# EAGLE design telematics_board_v2 (EAGLE 9.7.0)
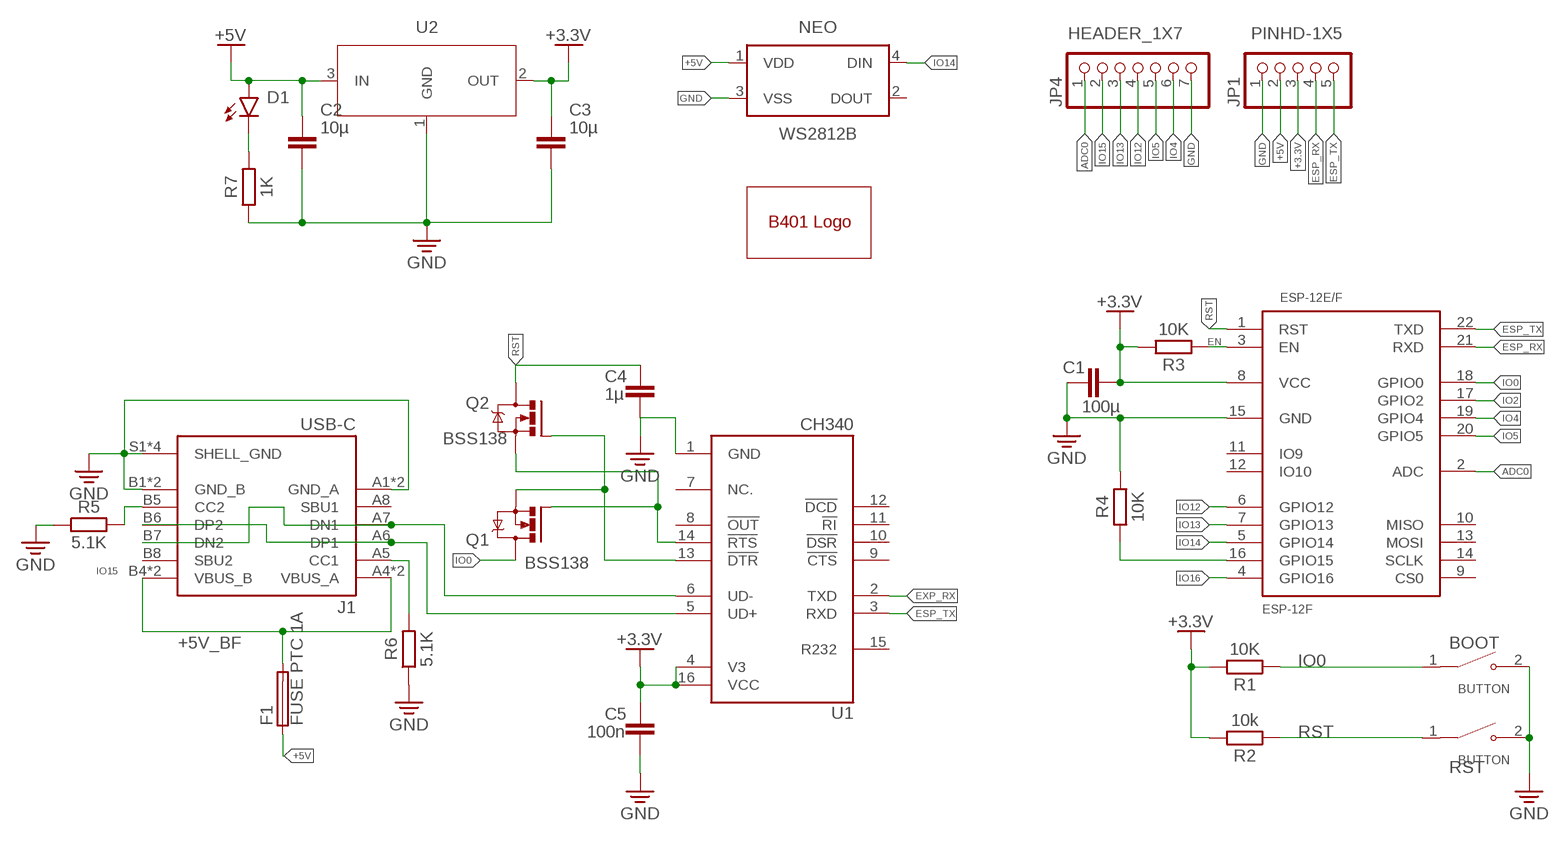
[diagram p0: schematic, sheet 1]

## Parts
BOOT  BUTTON  [SWITCH-2P]
C1  100µ  C_TANTALUM-2412(6032-METRIC)  [CAPM6032X280]
C2  10µ  C_CHIP-0805(2012-METRIC)  [CAPC2012X110]
C3  10µ  C_CHIP-0805(2012-METRIC)  [CAPC2012X110]
C4  1µ  C_CHIP-0805(2012-METRIC)  [CAPC2012X110]
C5  100n  C_CHIP-0805(2012-METRIC)  [CAPC2012X110]
D1  LED_RED  CHIP-FLAT-R_0805  [LEDC2012X110N_FLAT-R]
ESP-12E/F  ESP-12F  [ESP-12F]
F1  FUSE PTC 1A  FUSE_CHIP-1206(3216-METRIC)  [FUSC3215X82N]
J1  USB-C  [USB-C-16P]
JP1  PINHD-1X5  HEADER_1X5  [1X05]
JP4  HEADER_1X7  [1X07]
NEO  WS2812B  [WS2812B]
Q1  BSS138  NMOSFETSOT23-GSD  [SOT23]
Q2  BSS138  NMOSFETSOT23-GSD  [SOT23]
R1  10K  R_CHIP-0805(2012-METRIC)  [RESC2012X65]
R2  10k  R_CHIP-0805(2012-METRIC)  [RESC2012X65]
R3  10K  R_CHIP-0805(2012-METRIC)  [RESC2012X65]
R4  10K  R_CHIP-0805(2012-METRIC)  [RESC2012X65]
R5  5.1K  R_CHIP-0805(2012-METRIC)  [RESC2012X65]
R6  5.1K  R_CHIP-0805(2012-METRIC)  [RESC2012X65]
R7  1K  R_CHIP-0805(2012-METRIC)  [RESC2012X65]
RST  BUTTON  [SWITCH-2P]
U1  CH340  [SOIC127P600X180-16N]
U2  NCP1117ST33T3G  NCP1117ST33T3GSOT-223  [SOT230P700X170-4]
U$1  LOGO_B401LARGE  [B401_LARGE]

## Nets
+3.3V: C1.2 C3.1 C5.1 ESP-12E/F.8(VCC) JP1.3 R1.2 R2.2 R3.2 U1.4(V3) U1.16(VCC) U2.2(OUT)
+5V: C2.1 D1.A F1.1 JP1.2 NEO.1(VDD) U2.3(IN)
+5V_BF: F1.2 J1.A4(VBUS_A) J1.A9(VBUS_A) J1.B4(VBUS_B) J1.B9(VBUS_B)
ADC0: ESP-12E/F.2(ADC) JP4.1
EN: ESP-12E/F.3(EN) R3.1
ESP_RX: ESP-12E/F.21(RXD) JP1.4
ESP_TX: ESP-12E/F.22(TXD) JP1.5 U1.3(RXD)
EXP_RX: U1.2(TXD)
GND: BOOT.2 C1.1 C2.2 C3.2 C4.2 C5.2 ESP-12E/F.15(GND) J1.A1(GND_A) J1.A12(GND_A) J1.B1(GND_B) J1.B12(GND_B) J1.S1(SHELL_GND) J1.S2(SHELL_GND) J1.S3(SHELL_GND) J1.S4(SHELL_GND) JP1.1 JP4.7 NEO.3(VSS) R4.2 R5.1 R6.1 R7.1 RST.2 U1.1(GND) U2.1(GND)
IO0: BOOT.1 ESP-12E/F.18(GPIO0) Q1.3(D) R1.1
IO2: ESP-12E/F.17(GPIO2)
IO4: ESP-12E/F.19(GPIO4) JP4.6
IO5: ESP-12E/F.20(GPIO5) JP4.5
IO12: ESP-12E/F.6(GPIO12) JP4.4
IO13: ESP-12E/F.7(GPIO13) JP4.3
IO14: ESP-12E/F.5(GPIO14) NEO.4(DIN)
IO15: ESP-12E/F.16(GPIO15) JP4.2 R4.1
IO16: ESP-12E/F.4(GPIO16)
N$1: J1.A6(DP1) J1.B6(DP2) U1.5(UD+)
N$2: J1.A7(DN1) J1.B7(DN2) U1.6(UD-)
N$4: Q1.2(S) Q2.1(G) U1.13(!DTR)
N$5: J1.B5(CC2) R5.2
N$6: J1.A5(CC1) R6.2
N$8: Q1.1(G) Q2.2(S) U1.14(!RTS)
N$9: D1.C R7.2
RST: C4.1 ESP-12E/F.1(RST) Q2.3(D) R2.1 RST.1
Unconnected: ESP-12E/F.9(CS0) ESP-12E/F.10(MISO) ESP-12E/F.11(IO9) ESP-12E/F.12(IO10) ESP-12E/F.13(MOSI) ESP-12E/F.14(SCLK) J1.A8(SBU1) J1.B8(SBU2) NEO.2(DOUT) U1.7(NC.) U1.8(!OUT) U1.9(!CTS) U1.10(!DSR) U1.11(!RI) U1.12(!DCD) U1.15(R232)

## Library data of the parts
BOOT RST = WorTel Libray 2024:BUTTON; MANUFACTURER: CUI Devices; MAXIMUM_PACKAGE_HEIGHT: 2.5 mm; PARTREV: 1.0; STANDARD: Manufacturer Recommendations
C1-C5 = Capacitor:C: Capacitor - Generic; CATEGORY: Capacitor
D1 = LED:CHIP-FLAT-R; CATEGORY: LED; COLOR: RED; DESCRIPTION: CHIP LED FLAT; SUB-CATEGORY: CHIP; TYPE: FLAT_TOP
ESP-12E/F = WorTel Libray 2024:ESP-12F
F1 = Circuit-Protection:FUSE: Fuse - Generic; CATEGORY: Circuit-Protection; SUB-CATEGORY: Fuse
J1 = WorTel Libray 2024:USB-C: Check availability <https://pricing.snapeda.com/parts/CSP-USC16-TR/Valcon/view-part?ref=eda>; AVAILABILITY: In Stock; CHECK_PRICES: https://www.snapeda.com/parts/CSP-USC16-TR/Valcon/view-part/?ref=eda; DESCRIPTION: CSP-USC16-TR Valcon USB Type C Surface Mount PCB Socket; MF: Valcon; MP: CSP-USC16-TR; PACKAGE: None; PRICE: None; SNAPEDA_LINK: https://www.snapeda.com/parts/CSP-USC16-TR/Valcon/view-part/?ref=snap
JP1 = WorTel Libray 2024:HEADER_1X5: PIN HEADER; CATEGORY: Headers; DESCRIPTION: Header, Straight, 5 Position; MANUFACTURER: Generic; MPN: Generic; OPERATING_TEMPERATURE: Generic; PART_STATUS: Active; PITCH: 0.100" (2.54mm); ROHS_COMPLIANCE: Generic; SERIES: Generic; SUB-CATEGORY: Headers, Male Pins; TYPE: Board to Board or Cable, Unshrouded, Through Hole, Straight
JP4 = WorTel Libray 2024:HEADER_1X7: PIN HEADER; CATEGORY: Headers; DESCRIPTION: Header, Straight, 7 Position; MANUFACTURER: Generic; MPN: Generic; OPERATING_TEMPERATURE: Generic; PART_STATUS: Active; PITCH: 0.100" (2.54mm); ROHS_COMPLIANCE: Generic; SERIES: Generic; SUB-CATEGORY: Headers, Male Pins; TYPE: Board to Board or Cable, Unshrouded, Through Hole, Straight
NEO = LED:WS2812B: Intelligent control LED integrated light source Datasheet <http://cdn.sparkfun.com/datasheets/BreakoutBoards/WS2812B.pdf>; CATEGORY: LED; COLOR: RGB; DESCRIPTION: LED integrated light source; MANUFACTURER: Worldsemi; MPN: WS2812B; OPERATING_TEMP: -25 ℃ to +80℃(TJ); PART_STATUS: Active; SUB_CATEGORY: RGB
Q1 Q2 = Transistor:NMOSFET: N-Channel MOSFET - Generic; CATEGORY: Transistor; SUB-CATEGORY: MOSFET; TYPE: N-Channel; VALUE: NMOSFET
R1-R7 = Resistor:R: Resistor Fixed - Generic; CATEGORY: Resistor; SUB-CATEGORY: Fixed
U1 = WorTel Libray 2024:CH340: USB to serial chip CH340 Check availability <https://pricing.snapeda.com/parts/CH340C/WCH/view-part?ref=eda>; AVAILABILITY: Not in stock; CHECK_PRICES: https://www.snapeda.com/parts/CH340C/WCH/view-part/?ref=eda; DESCRIPTION: USB to serial chip CH340; MF: WCH; MP: CH340C; PACKAGE: None; PRICE: None; SNAPEDA_LINK: https://www.snapeda.com/parts/CH340C/WCH/view-part/?ref=snap
U2 = IC_Power-Management:NCP1117ST33T3G: 1.0 A Low-Dropout Positive Fixed and Adjustable Voltage Regulators Datasheet <https://www.onsemi.com/pub/Collateral/NCP1117-D.PDF>; CATEGORY: IC_Power-Management; MANUFACTURER: ON Semiconductor; MPN: NCP1117ST33T3G; OPERATING_TEMP: 0 to +125 °C; PART_STATUS: Active; ROHS_COMPLIANT: RoHS3 Compliant; SERIES: NCP1117, NCV1117; SUB-CATEGORY: Voltage Regulator; TYPE: Linear
U$1 = WorTel Libray 2024:LOGO_B401

## Board
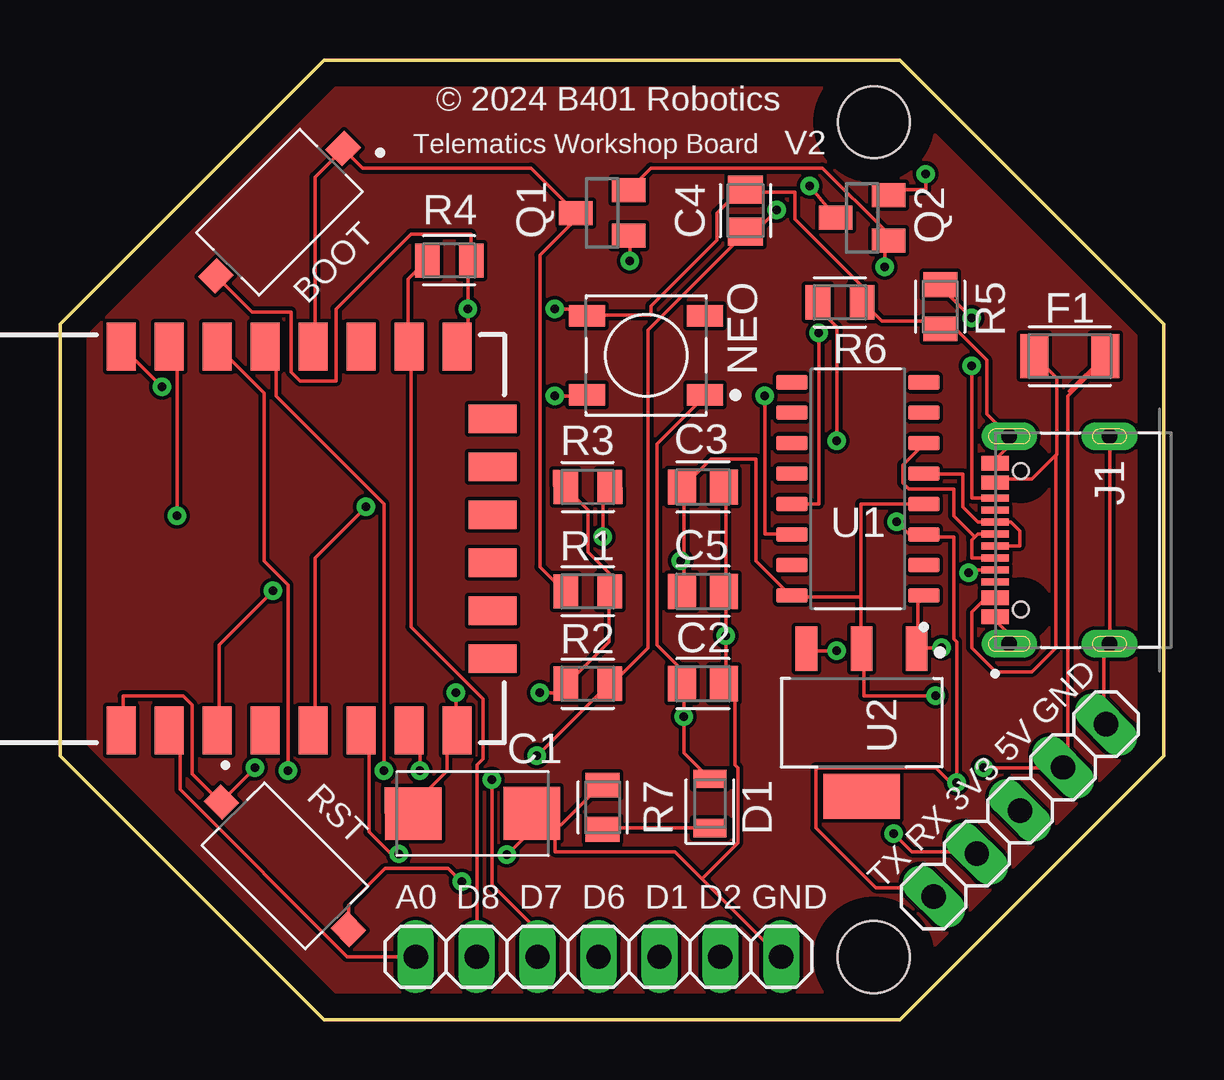
[diagram p1: board, top side]
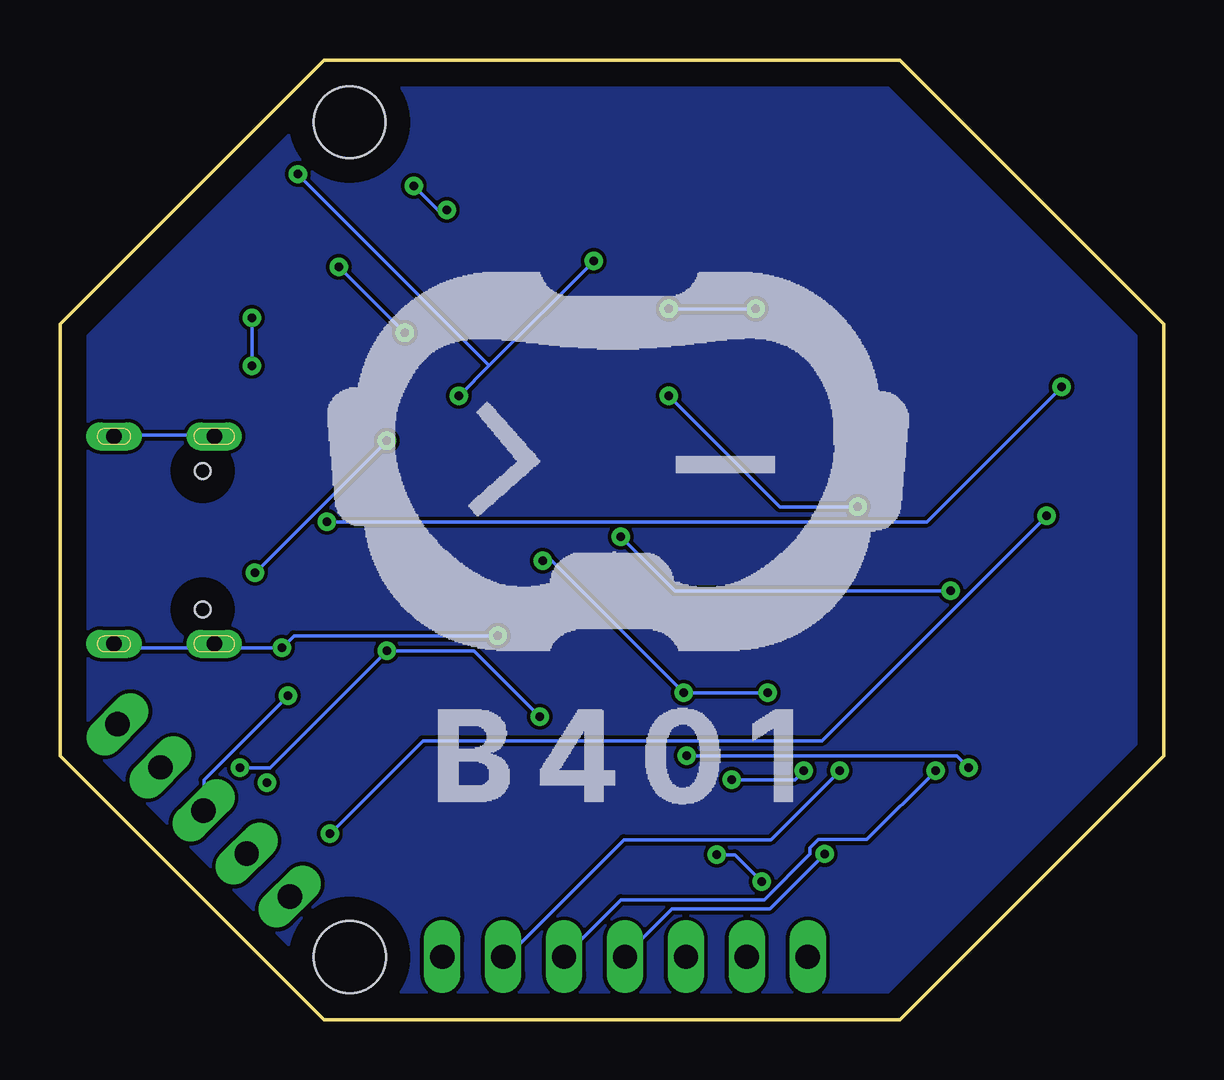
[diagram p2: board, bottom side, seen from below]

Size 46 x 40 mm. Coordinates in mm from the lower left corner, seen from the top.
Outline: 11,40 35,40 46,29 46,11 35,0 11,0 0,11 0,29 11,40
Copper layers (1*16): Top 0.035mm / dielectric 1.5mm / Bottom 0.035mm
Design rules "default *": minimum track width 6mil, minimum drill 0.35mm, track to track 6mil, track to pad 6mil, pad to pad 6mil, via to via 6mil, smd to smd 6mil, copper to edge 40mil, drill to drill 6mil, minimum pad ring 10mil, minimum via ring 8mil, stop-mask expansion 4mil, vias tented up to drill 0mil, thermal gap 10mil
Holes 3 mm at 33.93,37.41 33.92,2.6

### Footprints (pad centres in the part's own frame; a part is rotated, then mirrored left to right if it is on the bottom)
SWITCH-2P = smd 1.1 x 1: 1 -3.75,0; 2 3.75,0
CAPM6032X280 = smd 2.368 x 2.204: 1 -2.471,0; 2 2.471,0
CAPC2012X110 = smd 1.165 x 1.465: 1 -0.875,0; 2 0.875,0
LEDC2012X110N_FLAT-R = smd 0.762 x 1.362: A 1.025,0; C -1.025,0
ESP-12F = smd 2 x 1.2: 1 -8,3.48; 2 -8,1.48; 3 -8,-0.52; 4 -8,-2.52; 5 -8,-4.52; 6 -8,-6.52; 7 -8,-8.52; 8 -8,-10.52; 15 8,-10.52; 16 8,-8.52; 17 8,-6.52; 18 8,-4.52; 19 8,-2.52; 20 8,-0.52; 21 8,1.48; 22 8,3.48 | smd 1.2 x 2: 9 -5,-12; 10 -3,-12; 11 -1,-12; 12 1,-12; 13 3,-12; 14 5,-12
FUSC3215X82N = smd 1.165 x 1.814: 1 -1.475,0; 2 1.475,0
USB-C-16P = smd 0.3 x 1.14: A1 -3.35,0; A4 -2.55,0; A5 -1.25,0; A6 -0.25,0; A7 0.25,0; A8 1.25,0; A9 2.55,0; A12 3.35,0; B1 3.05,0; B4 2.25,0; B5 1.75,0; B6 0.75,0; B7 -0.75,0; B8 -1.75,0; B9 -2.25,0; B12 -3.05,0 | drill 0.65 pad 1 long: S1 -4.325,-0.59; S2 4.325,-0.59 | drill 0.65 pad 0.9 long: S3 -4.325,-4.77; S4 4.325,-4.77 | hole 0.65: -2.89,-1.07; 2.89,-1.07
1X05 = drill 1.016 long: 1 -5.08,0; 2 -2.54,0; 3 0,0; 4 2.54,0; 5 5.08,0
1X07 = drill 1.016 long: 1 -7.62,0; 2 -5.08,0; 3 -2.54,0; 4 0,0; 5 2.54,0; 6 5.08,0; 7 7.62,0
WS2812B = smd 1.5 x 0.9: 1 -2.45,1.65; 2 -2.45,-1.65; 3 2.45,-1.65; 4 2.45,1.65
SOT23 = smd 1 x 1.4: 1 -0.95,-1.1; 2 0.95,-1.1; 3 0,1.1
RESC2012X65 = smd 1.031 x 1.42: 1 -0.919,0; 2 0.919,0
SOIC127P600X180-16N = smd 1.31 x 0.62: 1 -2.75,4.445; 2 -2.75,3.175; 3 -2.75,1.905; 4 -2.75,0.635; 5 -2.75,-0.635; 6 -2.75,-1.905; 7 -2.75,-3.175; 8 -2.75,-4.445; 9 2.75,-4.445; 10 2.75,-3.175; 11 2.75,-1.905; 12 2.75,-0.635; 13 2.75,0.635; 14 2.75,1.905; 15 2.75,3.175; 16 2.75,4.445
SOT230P700X170-4 = smd 1.86 x 0.898: 1 -3.075,2.3; 2 -3.075,0; 3 -3.075,-2.3 | smd 1.86 x 3.189: 4 3.075,0

### Placement (x,y rotation side)
BOOT  9.15,33.65 225 top
C1  17.2,8.59 180.1 top
C2  26.8,14 0 top
C3  26.8,22.2 0 top
C4  28.57,33.72 90 top
C5  26.8,17.85 0 top
D1  27.1,9.01 90 top
ESP-12E/F  6.03,20.04 90 top
F1  42.09,27.66 180 top
J1  38.98,19.98 90 top
JP1  40.01,8.71 225 top
JP4  22.45,2.62 0 top
NEO  24.43,27.68 180 top
Q1  22.61,33.62 90 top
Q2  33.44,33.42 90 top
R1  22,17.85 0 top
R2  22,14 180 top
R3  22,22.2 180.2 top
R4  16.23,31.64 0 top
R5  36.69,29.71 90 top
R6  32.52,29.9 180 top
R7  22.62,8.85 270 top
RST  9.38,6.41 315 top
U1  33.26,22.12 180 top
U2  33.42,12.38 270 top
U$1  23,22.5 0 bottom

### Tracks (layer width: path | path; a pad name or v marks a point on that pad's centre or on a via)
+3.3V  (via drill 0.35)
  Top 0.152: C1.2 14.75,8.62 14.75,9 16.12,10.38 16.12,11.62 16.5,12 ESP-12E/F.8 16.5,12.12 v16.5,13.62 | R3.2 21.12,22.12 22,21.25 22,19.5 22.88,18.62 22.88,17.88 R1.2 22.88,17.75 22.88,15.75 21.12,14 R2.2 21,14 21,13.62 v20,13.62 | 26,19.12 26,22.12 C3.1 26,22.25 27.12,23.38 29,23.38 29,19.12 30.5,17.62 U1.16 30.62,17.62 33.38,17.62 | 26,19.12 26,17.88 C5.1 | 33.38,17.62 33.38,15.5 U2.2 33.5,15.38 33.5,13.5 v36.5,13.5 | 33.38,17.62 33.38,21.5 U1.4 | 26,19.12 v25.88,19.12
  Bottom 0.152: v16.5,13.62 v20,13.62 25.5,19.12 v25.88,19.12 | v36.5,13.5 40,10 40,9 JP1.3
+5V  (via drill 0.35)
  Top 0.152: D1.A 27,10.12 26,11.12 v26,12.62 26,14 C2.1 25.88,14 25.88,14.62 24.88,15.62 24.88,24 26.88,26 NEO.1 | v32.38,15.38 31.12,15.38 U2.3 | 42.08,26.2 43.5,27.62 F1.1 43.5,27.5 42,26 42,11 JP1.2 41.5,10.5 v38.5,10.5
  Bottom 0.152: v26,12.62 28.75,15.38 v32.38,15.38 37.25,10.5 v38.5,10.5
+5V_BF
  Top 0.152: 41.49,23.51 40.52,22.53 J1.A9 J1.B4 | 41.49,23.51 41.54,23.56 41.54,26.73 F1.2 | 41.49,23.51 41.5,23.5 41.5,15.5 40.5,14.5 39,14.5 38,15.5 38,17 38.5,17.5 J1.A4 J1.B9
ADC0
  Top 0.152: ESP-12E/F.2 4.62,12 5,11.62 5,9.58 11.96,2.62 14.75,2.62 JP4.1
EN  (via drill 0.35)
  Top 0.152: v22.62,20.12 22.62,21.88 22.88,22.12 R3.1 | v8.88,17.88 6.62,15.62 6.62,12.12 ESP-12E/F.3
  Bottom 0.152: v22.62,20.12 20.38,17.88 v8.88,17.88
ESP_RX  (via drill 0.35)
  Top 0.152: v4.88,21 4.88,27.75 4.62,28 ESP-12E/F.21 | v34.75,7.75 35.5,7 38,7 JP1.4
  Bottom 0.152: v4.88,21 14.25,11.62 30.88,11.62 v34.75,7.75
ESP_TX  (via drill 0.35)
  Top 0.152: v4.25,26.38 2.62,28 ESP-12E/F.22 | v34.88,20.75 35.38,20.25 36,20.25 U1.3 36.12,20.12 37.25,20.12 37.25,15.88 37.38,15.75 v37.38,9.88 37,10 36.5,10.5 31.5,10.5 31.5,8 34,5.5 36,5.5 JP1.5
  Bottom 0.152: v4.25,26.38 9.88,20.75 v34.88,20.75
GND  (via drill 0.35)
  Top 0.152: 27.75,14 v27.75,16 27.75,17.75 C5.2 27.75,17.88 27.75,22.12 C3.2 | v18.62,6.88 19.62,7.88 19.62,8.12 | 19.62,8.12 19.62,8.5 C1.1 | 19.62,8.12 20.62,8.12 | 20.62,8.12 20.88,8.12 22.5,9.75 R7.1 | 19.62,8.12 C1.1 | 26.75,5.88 25.62,7 20.62,7 20.62,8.12 | 26.75,5.88 30,2.62 JP4.7 | 20.62,8.12 C1.1 | 27.75,14 28.12,13.62 28.12,10.62 28.25,10.5 28.25,7.38 26.75,5.88 | 27.75,14 C2.2 | 35.75,15.5 35.75,17.38 36,17.62 U1.1 | v36.75,15.5 35.75,15.5 | 35.75,15.5 U2.1 | BOOT.2 8,29.5 9.62,29.5 9.62,27 10,26.62 11.5,26.62 11.5,29.62 14.62,32.75 17.12,32.75 17.12,31.75 R4.2 17.12,31.62 17,31.5 v17,29.62 17,28.5 16.62,28.12 ESP-12E/F.15 | v20.62,29.62 21.88,29.62 21.88,29.38 NEO.3 22,29.38 24.62,29.38 24.62,29.75 27.38,32.5 27.38,33.62 28.25,34.5 28.5,34.5 C4.2 28.62,34.5 30.62,34.5 30.62,33.38 33.38,30.62 33.38,30 R6.1 33.5,29.88 34.25,29.12 36.62,29.12 36.62,28.88 R5.1 36.75,28.75 37.38,28.75 38.62,27.5 38.62,25.25 39.5,24.38 J1.S2 39.57,23.92 J1.A12 J1.B1 | J1.S4 43.75,24.25 43.75,15.75 J1.S3 43.5,15.5 43.5,12.5 JP1.1 | v16.75,5.75 16.71,5.75 16.17,6.29 13.55,6.29 12.03,4.77 RST.2 | J1.S1 39.57,16.04 J1.A1 J1.B12
  Bottom 0.152: v16.75,5.75 17.88,6.88 v18.62,6.88 | 39.75,15.5 39.62,15.62 J1.S1 39.75,15.5 | 39.75,15.5 43.5,15.5 43.62,15.62 J1.S3 | 39.75,15.5 v36.75,15.5 36.25,16 v27.75,16 | J1.S2 39.62,24.38 43.62,24.38 J1.S4 | v20.62,29.62 v17,29.62
IO0
  Top 0.152: ESP-12E/F.18 10.62,28.12 10.62,35.12 11.75,36.25 BOOT.1 12.61,35.5 19.62,35.5 Q1.3 21.5,33.5 21.5,33.38 20,31.88 20,18.88 21,17.88 R1.1
IO4  (via drill 0.35)
  Top 0.152: v13.5,10.38 13.5,21.5 9,26 9,27.62 8.62,28 ESP-12E/F.19
  Bottom 0.152: v13.5,10.38 16.38,7.5 22.5,7.5 27.38,2.62 27.5,2.62 JP4.6
IO5  (via drill 0.35)
  Top 0.152: v9.5,10.38 9.5,18.12 8.5,19.12 8.5,26.12 6.62,28 ESP-12E/F.20
  Bottom 0.152: JP4.5 22.62,5 16.64,5 14.73,6.91 14.73,7.15 14.38,7.51 12.37,7.51 v9.5,10.38
IO12  (via drill 0.35)
  Top 0.152: ESP-12E/F.6 12.62,12 12.88,11.75 12.88,7.82 13.8,6.9 v14.12,6.9
  Bottom 0.152: JP4.4 22.5,2.62 20.5,4.62 16.4,4.62 v14.12,6.9
IO13  (via drill 0.35)
  Top 0.152: v15,10.38 15,11.62 14.62,12 ESP-12E/F.7 | v18,10 18,5.62 19.88,3.75 19.88,2.62 JP4.3
  Bottom 0.152: v15,10.38 15.38,10 v18,10
IO14  (via drill 0.35)
  Top 0.152: v20.62,26 21.88,26 NEO.4 | v12.75,21.38 10.62,19.25 10.62,12.12 ESP-12E/F.5
  Bottom 0.152: v20.62,26 16,21.38 v12.75,21.38
IO15
  Top 0.152: R4.1 15.25,31.62 14.5,30.88 14.5,28.12 ESP-12E/F.16 14.62,28 14.62,16.38 17.62,13.38 17.62,10.88 17.38,10.62 JP4.2
N$1
  Top 0.152: J1.A6 39,19.75 40,19.75 40,20.38 39.62,20.75 39,20.75 J1.B6 38.88,20.75 38.25,20.75 37.62,21.38 37.62,22.75 36.12,22.75 U1.5
N$2
  Top 0.152: 38.12,20.12 38.25,20.25 38.88,20.25 J1.A7 | 38.12,20.12 38,20 38,19.25 38.88,19.25 J1.B7 | 38.12,20.12 37.25,21 37.25,22.12 35.38,22.12 35.12,22.38 35.12,23.12 36,24 U1.6
N$3
  pour Top: 46.92,11.03 46.92,29.42 46.48,29.42 46.46,29.44 35.47,40.42 10.53,40.42 -0.42,29.47 -0.42,10.53 10.53,-0.42 35.47,-0.42
N$4  (via drill 0.35)
  Top 0.152: v31.62,28.62 31.62,21.5 30.62,21.5 U1.13 | v34.38,31.38 34.38,32.45 Q2.1 34.38,32.62 34.38,32.91 31.78,35.5 24.64,35.5 Q1.2
  Bottom 0.152: v34.38,31.38 v31.62,28.62
N$5  (via drill 0.35)
  Top 0.152: v38,27.25 38,21.75 38.88,21.75 J1.B5 | v38,29.25 36.75,30.5 36.75,30.62 R5.2
  Bottom 0.152: v38,29.25 v38,27.25
N$6  (via drill 0.35)
  Top 0.152: v37.88,18.62 37.88,18.75 38.88,18.75 J1.A5 | v32.38,24.12 32.38,28.88 31.62,29.62 31.62,29.88 R6.2
  Bottom 0.152: v32.38,24.12 v37.88,18.62
N$7
  pour Bottom: 46.92,11.03 46.92,29.42 46.48,29.42 46.46,29.44 35.47,40.42 10.53,40.42 -0.42,29.47 -0.42,10.53 10.53,-0.42 35.47,-0.42
N$8  (via drill 0.35)
  Top 0.152: v29.38,26 29.38,20.25 30.5,20.25 U1.14 | v23.75,31.62 23.75,32.62 Q1.1 | Q2.2 34.57,34.6 36.09,34.6 v36.09,35.24
  Bottom 0.152: v23.75,31.62 28.11,27.27 | 28.11,27.27 v29.38,26 | 28.11,27.27 v36.09,35.24
N$9
  Top 0.152: D1.C 27,8 22.62,8 R7.2
RST  (via drill 0.35)
  Top 0.152: ESP-12E/F.1 2.62,12.12 2.62,13.5 5.12,13.5 5.5,13.12 5.5,10.25 6.62,9.12 RST.1 6.75,9.12 v8.12,10.5 | v31.25,34.75 31.26,34.74 Q2.3 | v29.88,33.75 29,32.88 28.62,32.88 C4.1 28.5,32.75 24.5,28.75 24.5,15.5 23,14 R2.1 22.88,14 v19.88,11
  Bottom 0.152: v31.25,34.75 30.25,33.75 v29.88,33.75 | v8.12,10.5 8.62,11 v19.88,11

### Text on the board
tPlace: © 2024 B401 Robotics | Telematics Workshop Board | V2 | TX RX 3V3 5V GND | A0 D8 D7 D6 D1 D2 GND